# EAGLE design iot (EAGLE 9.2.0)
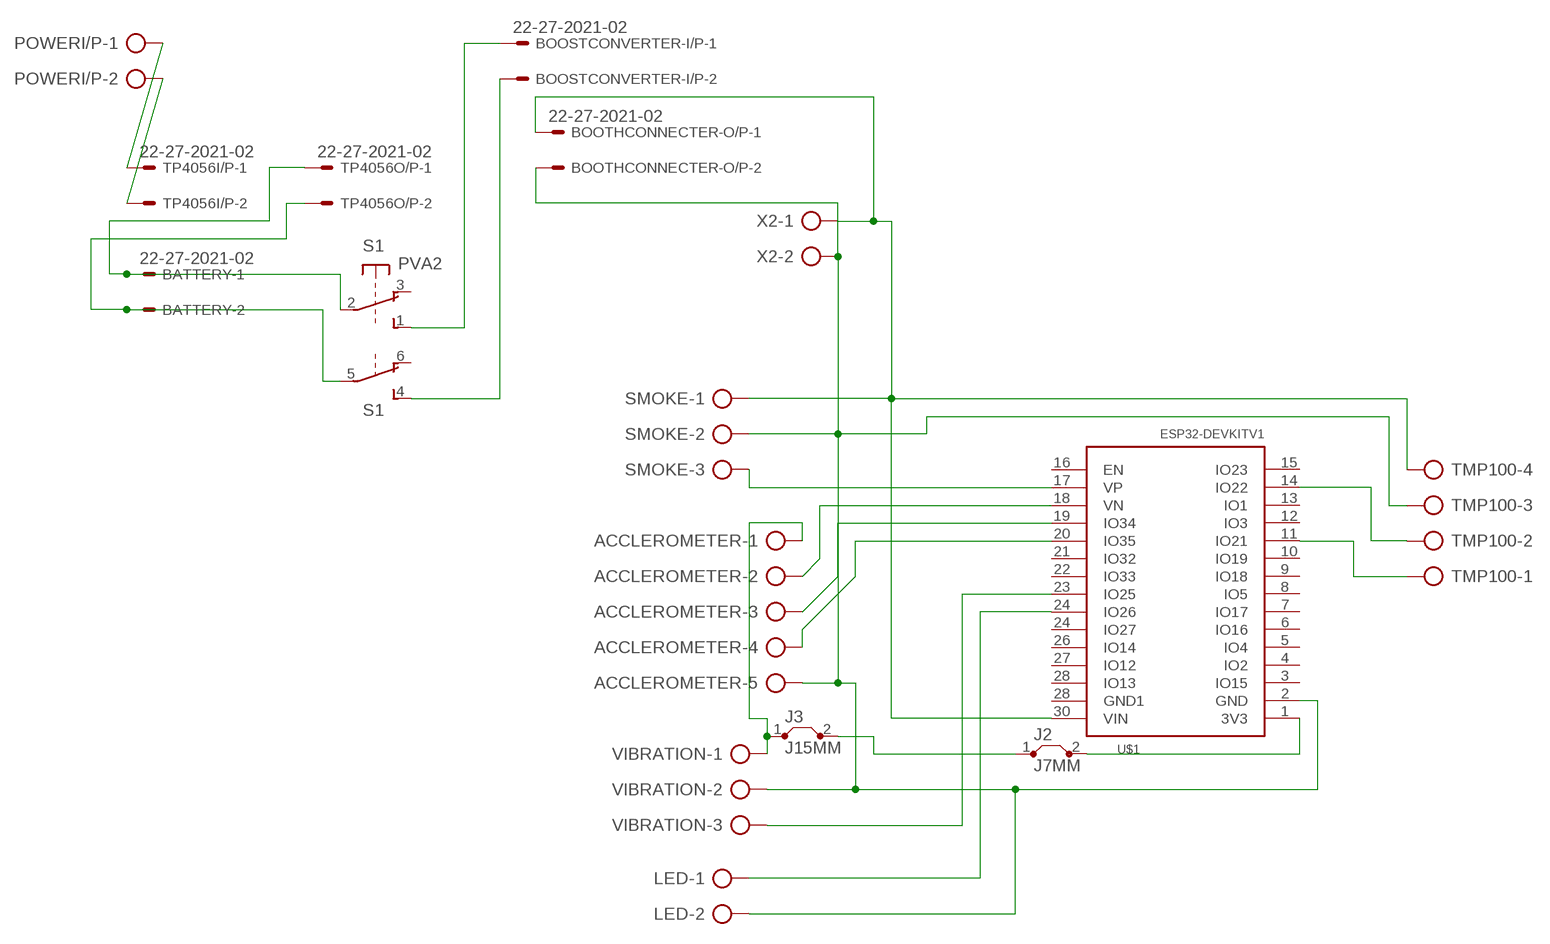
[diagram p0: schematic, sheet 1]

## Parts
ACCLEROMETER  AK500/5-H  [AK500/5-H]
BATTERY  22-27-2021-02  [6410-02]
BOOSTCONVERTER-I/P  22-27-2021-02  [6410-02]
BOOTHCONNECTER-O/P  22-27-2021-02  [6410-02]
J2  J7MM  [07]
J3  J15MM  [15]
LED  AK500/2-H  [AK500/2-H]
POWERI/P  AK500/2-H  [AK500/2-H]
S1  PVA2  [PVA2F]
SMOKE  AK500/3-H  [AK500/3-H]
TMP100  AK500/4-H  [AK500/4-H]
TP4056I/P  22-27-2021-02  [6410-02]
TP4056O/P  22-27-2021-02  [6410-02]
U$1  ESP32DEVKITV1  [ESP32-DEVKITV1]
VIBRATION  AK500/3-H  [AK500/3-H]
X2  AK500/2-H  [AK500/2-H]

## Nets
N$1: ACCLEROMETER.2 U$1.18(VN)
N$2: ACCLEROMETER.3 U$1.19(IO34)
N$3: ACCLEROMETER.4 U$1.20(IO35)
N$4: SMOKE.3 U$1.17(VP)
N$5: U$1.23(IO25) VIBRATION.3
N$6: TMP100.2 U$1.14(IO22)
N$7: TMP100.1 U$1.11(IO21)
N$8: BOOTHCONNECTER-O/P.1 SMOKE.1 TMP100.4 U$1.30(VIN) X2.1
N$9: J2.1 J3.2
N$10: ACCLEROMETER.1 J3.1 VIBRATION.1
N$11: ACCLEROMETER.5 BOOTHCONNECTER-O/P.2 LED.2 SMOKE.2 TMP100.3 U$1.2(GND) VIBRATION.2 X2.2
N$12: LED.1 U$1.24(IO26)
N$13: POWERI/P.1 TP4056I/P.1
N$14: POWERI/P.2 TP4056I/P.2
N$15: BATTERY.1 S1.2(1:P) TP4056O/P.1
N$16: BATTERY.2 S1.5(2:P) TP4056O/P.2
N$17: BOOSTCONVERTER-I/P.1 S1.1(1:S)
N$18: BOOSTCONVERTER-I/P.2 S1.4(2:S)
N$19: J2.2 U$1.1(3V3)
Unconnected: S1.3(1:O) S1.6(2:O) U$1.3(IO15) U$1.4(IO2) U$1.5(IO4) U$1.6(IO16) U$1.7(IO17) U$1.8(IO5) U$1.9(IO18) U$1.10(IO19) U$1.12(IO3) U$1.13(IO1) U$1.15(IO23) U$1.16(EN) U$1.21(IO32) U$1.22(IO33) U$1.24(IO27) U$1.26(IO14) U$1.27(IO12) U$1.28(GND1) U$1.28(IO13)

## Library data of the parts
ACCLEROMETER = con-ptr500:AK500/5-H: CONNECTOR Aug. 2004 / PTR Meßtechnik: Die Bezeichnung der Serie AK505 wurde geändert. Es handelt sich hierbei um AK500 in horizontaler Ausführung.; OC_FARNELL: unknown; OC_NEWARK: unknown
BATTERY BOOSTCONVERTER-I/P BOOTHCONNECTER-O/P TP4056I/P TP4056O/P = con-molex:22-?-02: CONNECTOR wire to board 2.54 mm (.1 inch) pitch header; MF: MOLEX; OC_FARNELL: unknown; OC_NEWARK: unknown
J2 J3 = jumper:J: Bridge
LED POWERI/P X2 = con-ptr500:AK500/2-H: CONNECTOR Aug. 2004 / PTR Meßtechnik: Die Bezeichnung der Serie AK505 wurde geändert. Es handelt sich hierbei um AK500 in horizontaler Ausführung.; OC_FARNELL: unknown; OC_NEWARK: unknown
S1 = switch-misc:PVA2: ITT SWITCH
SMOKE VIBRATION = con-ptr500:AK500/3-H: CONNECTOR Aug. 2004 / PTR Meßtechnik: Die Bezeichnung der Serie AK505 wurde geändert. Es handelt sich hierbei um AK500 in horizontaler Ausführung.; OC_FARNELL: unknown; OC_NEWARK: unknown
TMP100 = con-ptr500:AK500/4-H: CONNECTOR Aug. 2004 / PTR Meßtechnik: Die Bezeichnung der Serie AK505 wurde geändert. Es handelt sich hierbei um AK500 in horizontaler Ausführung.; OC_FARNELL: unknown; OC_NEWARK: unknown
U$1 = ESP32-DEVKITV1:ESP32DEVKITV1

## Board
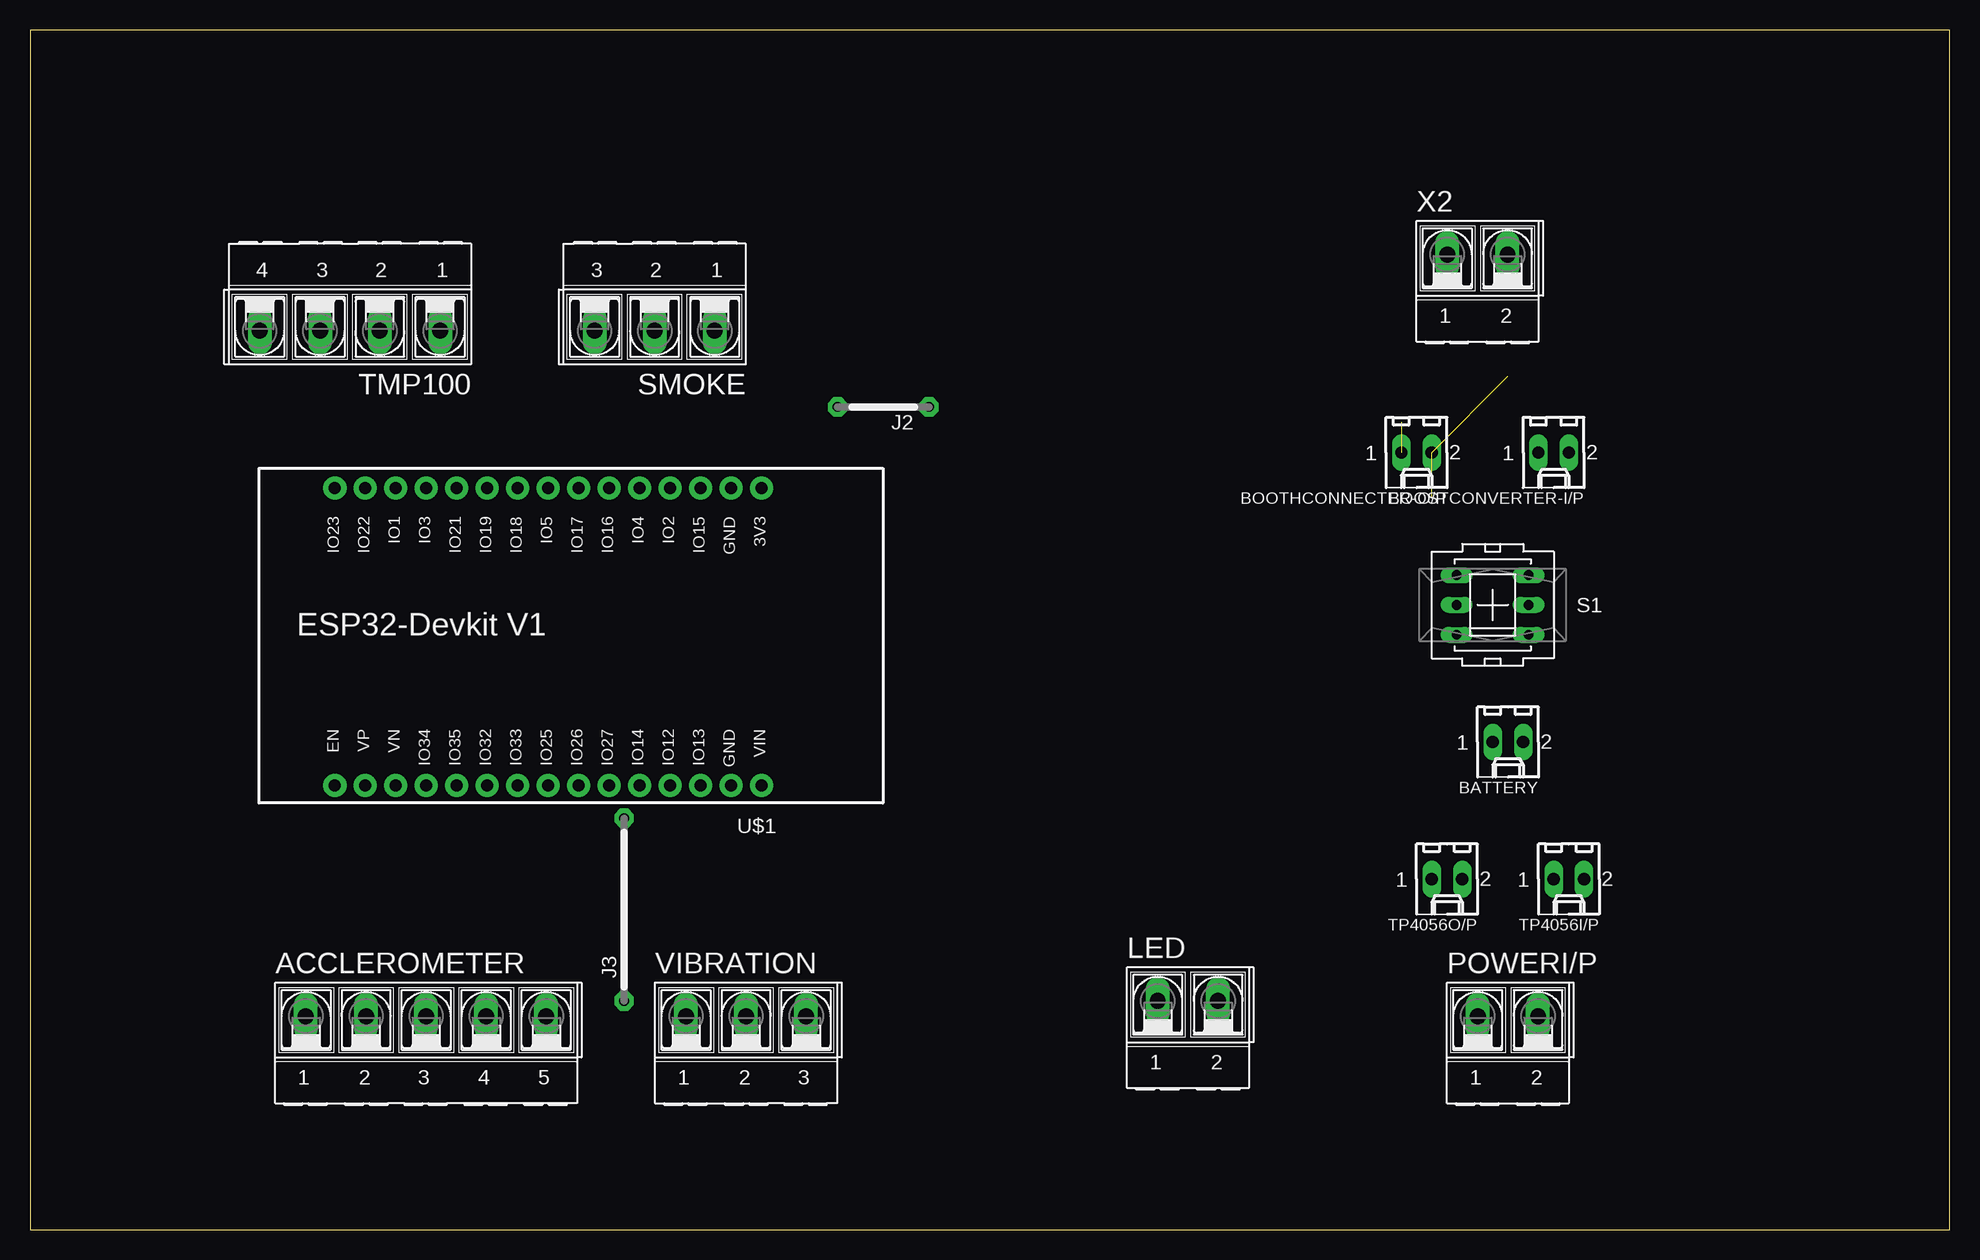
[diagram p1: board, top side]
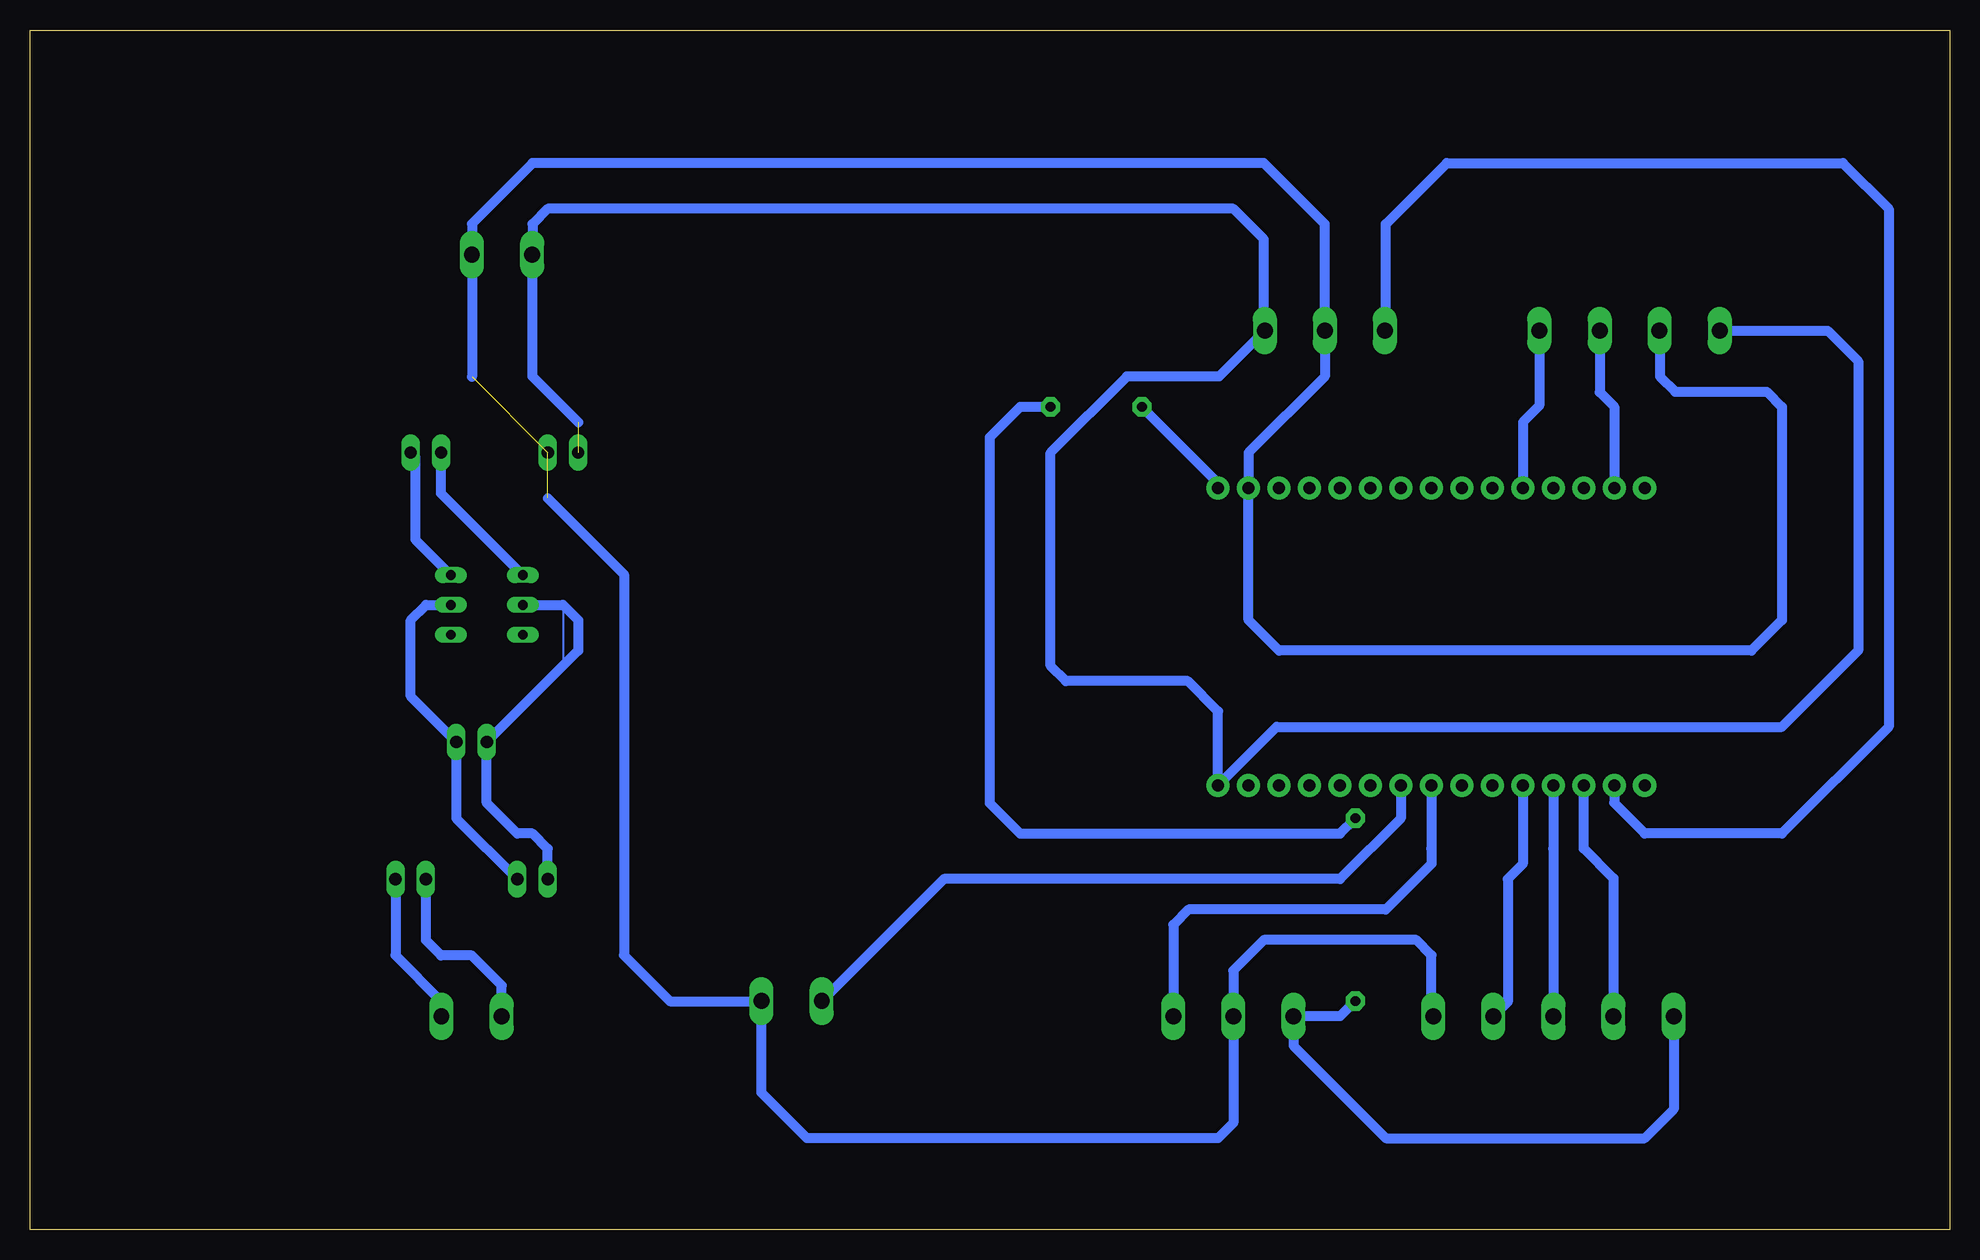
[diagram p2: board, bottom side, seen from below]

Size 160 x 100 mm. Coordinates in mm from the lower left corner, seen from the top.
Outline: 0,0 160,0 160,100 0,100 0,0
Copper layers (1*16): Top 0.035mm / dielectric 1.5mm / Bottom 0.035mm
Design rules "default": minimum track width 6mil, minimum drill 0.35mm, track to track 6mil, track to pad 6mil, pad to pad 6mil, via to via 6mil, smd to smd 6mil, copper to edge 40mil, drill to drill 6mil, minimum pad ring 10mil, minimum via ring 8mil, stop-mask expansion 4mil, vias tented up to drill 0mil, thermal gap 10mil

### Footprints (pad centres in the part's own frame; a part is rotated, then mirrored left to right if it is on the bottom)
AK500/5-H = drill 1.321 long: 1 -10.033,0; 2 -5.004,0; 3 0,0; 4 5.004,0; 5 10.008,0
6410-02 = drill 1.016 long: 1 1.27,0; 2 -1.27,0
07 = drill 0.813 pad 1.6 octagon: 1 -3.81,0; 2 3.81,0
15 = drill 0.813 pad 1.6 octagon: 1 -7.62,0; 2 7.62,0
AK500/2-H = drill 1.321 long: 1 -2.515,0; 2 2.515,0
PVA2F = drill 0.813 long: 1 -2.997,2.489; 2 -2.997,0; 3 -2.997,-2.489; 4 2.997,2.489; 5 2.997,0; 6 2.997,-2.489
AK500/3-H = drill 1.321 long: 1 -5.004,0; 2 0,0; 3 5.004,0
AK500/4-H = drill 1.321 long: 1 -7.518,0; 2 -2.489,0; 3 2.489,0; 4 7.518,0
ESP32-DEVKITV1 = drill 1 pad 1.93: 1 -22.87,-13.54; 2 -20.33,-13.54; 3 -17.79,-13.54; 4 -15.25,-13.54; 5 -12.71,-13.54; 6 -10.17,-13.54; 7 -7.63,-13.54; 8 -5.09,-13.54; 9 -2.55,-13.54; 10 -0.01,-13.54; 11 2.53,-13.54; 12 5.07,-13.54; 13 7.61,-13.54; 14 10.15,-13.54; 15 12.69,-13.54; 16 12.69,11.23; 17 10.15,11.23; 18 7.61,11.23; 19 5.07,11.23; 20 2.53,11.23; 21 -0.01,11.23; 22 -2.55,11.23; 23 -5.09,11.23; 24 -7.63,11.23; 25 -10.17,11.23; 26 -12.71,11.23; 27 -15.25,11.23; 28 -17.79,11.23; 29 -20.33,11.23; 30 -22.87,11.23

### Placement (x,y rotation side)
ACCLEROMETER  33.02,17.78 0 top
BATTERY  123.19,40.64 180 top
BOOSTCONVERTER-I/P  127,64.77 180 top
BOOTHCONNECTER-O/P  115.57,64.77 180 top
J2  71.12,68.58 180 top
J3  49.53,26.67 90 top
LED  96.52,19.05 0 top
POWERI/P  123.19,17.78 0 top
S1  121.92,52.07 0 top
SMOKE  52.07,74.93 180 top
TMP100  26.67,74.93 180 top
TP4056I/P  128.27,29.21 180 top
TP4056O/P  118.11,29.21 180 top
U$1  38.1,48.26 180 top
VIBRATION  59.69,17.78 0 top
X2  120.65,81.28 0 top

### Tracks (layer width: path | path; a pad name or v marks a point on that pad's centre or on a via)
N$1
  Bottom 0.813: ACCLEROMETER.2 28.02,29.29 30.49,31.76 U$1.18
N$2
  Bottom 0.813: U$1.19 33.03,31.76 33.02,31.75 ACCLEROMETER.3
N$3
  Bottom 0.152: U$1.20
  Bottom 0.813: U$1.20 35.57,30.47 36.83,29.21 36.83,18.97 ACCLEROMETER.4
N$4
  Bottom 0.813: SMOKE.3 46.99,75.01 46.99,83.82 41.91,88.9 8.89,88.9 5.08,85.09 5.08,41.91 13.97,33.02 25.4,33.02 27.95,35.57 U$1.17
N$5
  Bottom 0.152: 43.18,36.83 U$1.23
  Bottom 0.813: VIBRATION.3 64.69,25.4 63.42,26.67 46.99,26.67 43.18,30.48 43.18,31.75 43.19,31.76 U$1.23
N$6
  Bottom 0.152: 27.95,62.23 U$1.14
  Bottom 0.813: TMP100.2 29.16,69.8 27.95,68.59 27.95,62.23
N$7
  Bottom 0.152: 35.57,62.23 U$1.11
  Bottom 0.813: TMP100.1 34.19,68.68 35.56,67.31 35.56,62.24 35.57,62.23
N$8  (1 unrouted)
  Bottom 0.152: 58.63,39.37 U$1.30 61.17,36.83
  Bottom 0.813: TMP100.4 10.16,74.93 7.62,72.39 7.62,48.26 13.97,41.91 56.09,41.91 U$1.30 60.97,43.19 63.5,45.72 73.66,45.72 74.93,46.99 74.93,64.77 68.58,71.12 60.88,71.12 SMOKE.1 | 114.3,67.31 118.14,71.14 X2.1 118.11,81.31 118.11,83.82 116.84,85.09 59.69,85.09 57.15,82.55 57.15,75.01 SMOKE.1 | SMOKE.1 57.15,74.85
N$9
  Bottom 0.813: J2.1 77.47,68.58 80.01,66.04 80.01,35.56 77.47,33.02 50.8,33.02 J3.2
N$10
  Bottom 0.813: ACCLEROMETER.1 22.99,10.03 25.4,7.62 46.99,7.62 54.69,15.32 VIBRATION.1 50.8,17.78 J3.1
N$11  (2 unrouted)
  Bottom 0.152: 99.06,13.97 99.06,19.02 LED.2 106.68,19.05 | 58.43,62.23 U$1.2 | 120.65,86.36 123.17,83.84
  Bottom 0.813: TMP100.3 24.13,74.88 24.13,71.12 22.86,69.85 15.24,69.85 13.97,68.58 13.97,50.8 16.51,48.26 55.88,48.26 58.43,50.81 U$1.2 | 58.43,62.23 58.43,64.76 52.07,71.12 SMOKE.2 52.07,83.82 57.15,88.9 118.11,88.9 123.17,83.84 X2.2 123.17,71.09 | 116.84,60.96 110.49,54.61 110.49,22.86 106.68,19.05 106.66,19.02 99.06,19.02 | LED.2 99.03,11.4 95.25,7.62 60.96,7.62 59.69,8.89 VIBRATION.2 59.69,21.59 57.15,24.13 44.45,24.13 43.18,22.86 43.18,17.93 ACCLEROMETER.5
N$12
  Bottom 0.152: 93.98,19.05 LED.1
  Bottom 0.813: U$1.24 45.73,34.28 50.8,29.21 83.82,29.21 93.98,19.05
N$13
  Bottom 0.813: POWERI/P.1 120.67,20.34 123.18,22.85 125.74,22.85 127,24.11 TP4056I/P.1
N$14
  Bottom 0.152: 125.72,17.79 POWERI/P.2
  Bottom 0.813: TP4056I/P.2 129.54,22.86 125.72,19.04 125.72,17.79
N$15
  Bottom 0.152: BATTERY.1 115.57,46.99 115.57,52.07
  Bottom 0.813: TP4056O/P.1 116.84,31.75 118.11,33.02 119.38,33.02 121.92,35.56 BATTERY.1 114.3,48.26 114.3,50.8 115.57,52.07 S1.2
N$16
  Bottom 0.813: TP4056O/P.2 124.46,34.29 BATTERY.2 128.27,44.45 128.27,50.8 127,52.07 S1.5
N$17
  Bottom 0.813: S1.1 125.73,61.37 BOOSTCONVERTER-I/P.1
N$18
  Bottom 0.813: BOOSTCONVERTER-I/P.2 127.89,64.39 127.89,57.53 S1.4
N$19
  Bottom 0.813: J2.2 60.97,62.24 U$1.1